# EAGLE design Thermostat-V3 (EAGLE 5.06)
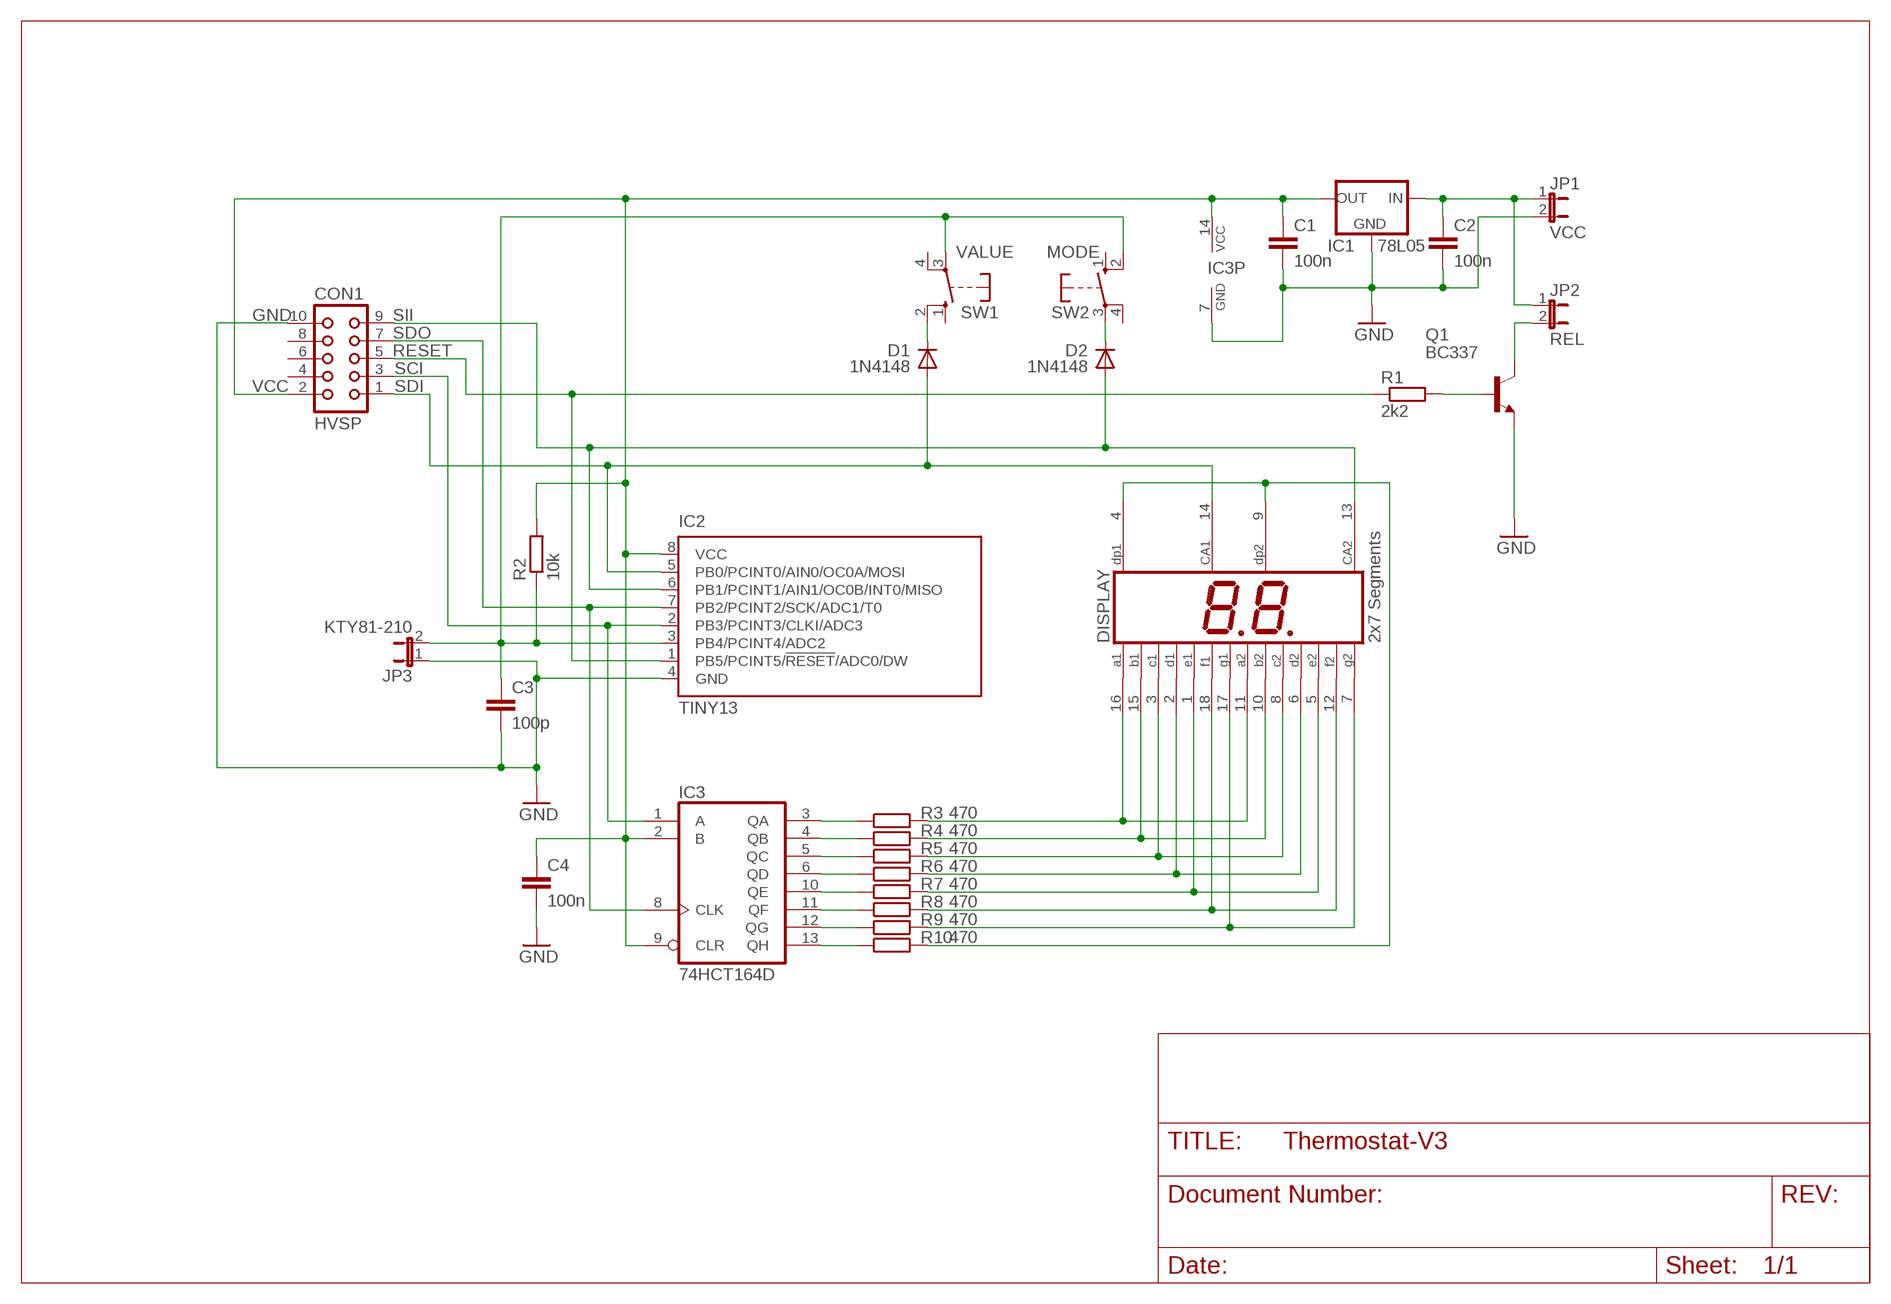
[diagram p0: schematic, sheet 1]

## Parts
C1  100n  C-EU025-024X044  [C025-024X044]
C2  100n  C-EU025-024X044  [C025-024X044]
C3  100p  C-EU025-024X044  [C025-024X044]
C4  100n  C-EU025-024X044  [C025-024X044]
CON1  HVSP  CON10  [CON10]
D1  1N4148  1N4148DO35-7  [DO35-7]
D2  1N4148  1N4148DO35-7  [DO35-7]
DISPLAY  2x7 Segments  HD-K121  [HDSP-R]
IC1  78L05  78LXX  [78LXX]
IC2  TINY13  TINY13-20SSU  [8S1]
IC3  74HCT164D  [SO14]
JP1  VCC  JP1E  [JP1]
JP2  REL  JP1E  [JP1]
JP3  KTY81-210  JP1E  [JP1]
Q1  BC337  BC337-40  [TO92]
R1  2k2  R-EU_0207/7  [0207/7]
R2  10k  R-EU_0207/7  [0207/7]
R3  470  R-EU_0207/7  [0207/7]
R4  470  R-EU_0207/7  [0207/7]
R5  470  R-EU_0207/7  [0207/7]
R6  470  R-EU_0207/7  [0207/7]
R7  470  R-EU_0207/7  [0207/7]
R8  470  R-EU_0207/7  [0207/7]
R9  470  R-EU_0207/7  [0207/7]
R10  470  R-EU_0207/7  [0207/7]
SW1  VALUE  DTE6  [DTE6-N]
SW2  MODE  DTE6  [DTE6-N]

## Nets
GND: C1.2 C2.2 C3.2 C4.2 CON1.10 IC1.GND IC2.4(GND) IC3.7(GND) JP1.2 JP3.1 Q1.1(E)
N$1: IC3.3(QA) R3.1
N$2: IC3.4(QB) R4.1
N$3: IC3.5(QC) R5.1
N$4: IC3.6(QD) R6.1
N$5: IC3.10(QE) R7.1
N$6: IC3.11(QF) R8.1
N$7: IC3.12(QG) R9.1
N$8: IC3.13(QH) R10.1
N$9: DISPLAY.11(A2) DISPLAY.16(A1) R3.2
N$10: DISPLAY.10(B2) DISPLAY.15(B1) R4.2
N$11: DISPLAY.3(C1) DISPLAY.8(C2) R5.2
N$12: DISPLAY.2(D1) DISPLAY.6(D2) R6.2
N$13: DISPLAY.1(E1) DISPLAY.5(E2) R7.2
N$14: DISPLAY.12(F2) DISPLAY.18(F1) R8.2
N$15: DISPLAY.7(G2) DISPLAY.17(G1) R9.2
N$16: DISPLAY.4(DP1) DISPLAY.9(DP2) R10.2
N$17: C3.1 IC2.3(PB4/PCINT4/ADC2) JP3.2 R2.1 SW1.3(P) SW2.2(S)
N$18: D1.C SW1.2(S)
N$19: D2.C SW2.3(P)
N$23: C2.1 IC1.IN JP1.1 JP2.1
N$26: Q1.2(B) R1.2
N$27: JP2.2 Q1.3(C)
RESET: CON1.5 IC2.1(PB5/PCINT5/!RESET!/ADC0/DW) R1.1
SCI: CON1.3 IC2.2(PB3/PCINT3/CLKI/ADC3) IC3.1(A)
SDI: CON1.1 D1.A DISPLAY.14(CA1) IC2.5(PB0/PCINT0/AIN0/OC0A/MOSI)
SDO: CON1.7 IC2.7(PB2/PCINT2/SCK/ADC1/T0) IC3.8(CLK)
SII: CON1.9 D2.A DISPLAY.13(CA2) IC2.6(PB1/PCINT1/AIN1/OC0B/INT0/MISO)
VCC: C1.1 C4.1 CON1.2 IC1.OUT IC2.8(VCC) IC3.2(B) IC3.9(CLR) IC3.14(VCC) R2.2
Unconnected: CON1.4 CON1.6 CON1.8 SW1.1(S) SW1.4(P) SW2.1(S) SW2.4(P)

## Library data of the parts
C1-C4 = rcl:C-EU: CAPACITOR, European symbol
CON1 = con-harting:CON10: CONNECTOR
D1 D2 = diode:1N4148: DIODE high speed (Philips)
DISPLAY = display-hp:HD-K121: LED DISPLAY 2 x 1 character 7 segment, decimal points right
IC1 = v-reg:78LXX: VOLTAGE REGULATOR
IC2 = atmel:TINY13: 8-bit AVR Microcontroller with 1K Bytes In-System Programmable Flash Source: http://www.atmel.com/dyn/resources/prod_documents/2535S.pdf
IC3 = 74xx-eu:74*164: 8-bit parallel out SHIFT REGISTER
JP1-JP3 = jumper:JP1E: JUMPER
Q1 = transistor-npn:BC337*: NPN Transistor
R1-R10 = rcl:R-EU_: RESISTOR, European symbol
SW1 SW2 = switch-misc:DT: ITT SWITCH

## Board
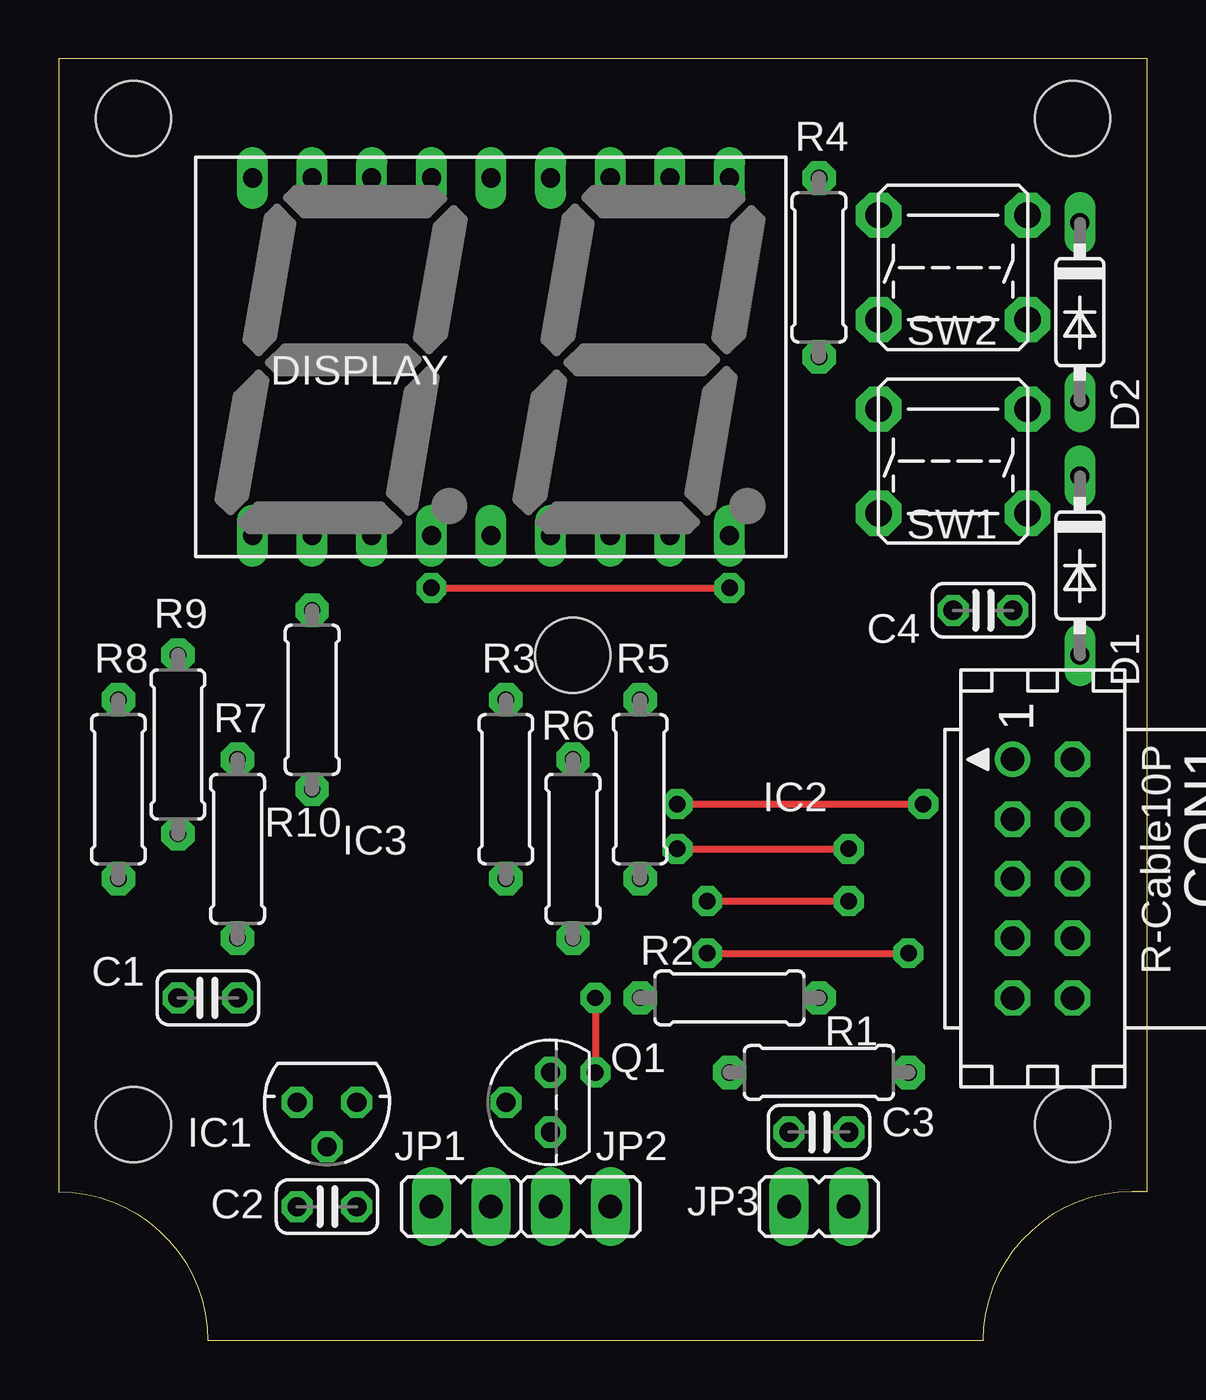
[diagram p1: board, top side]
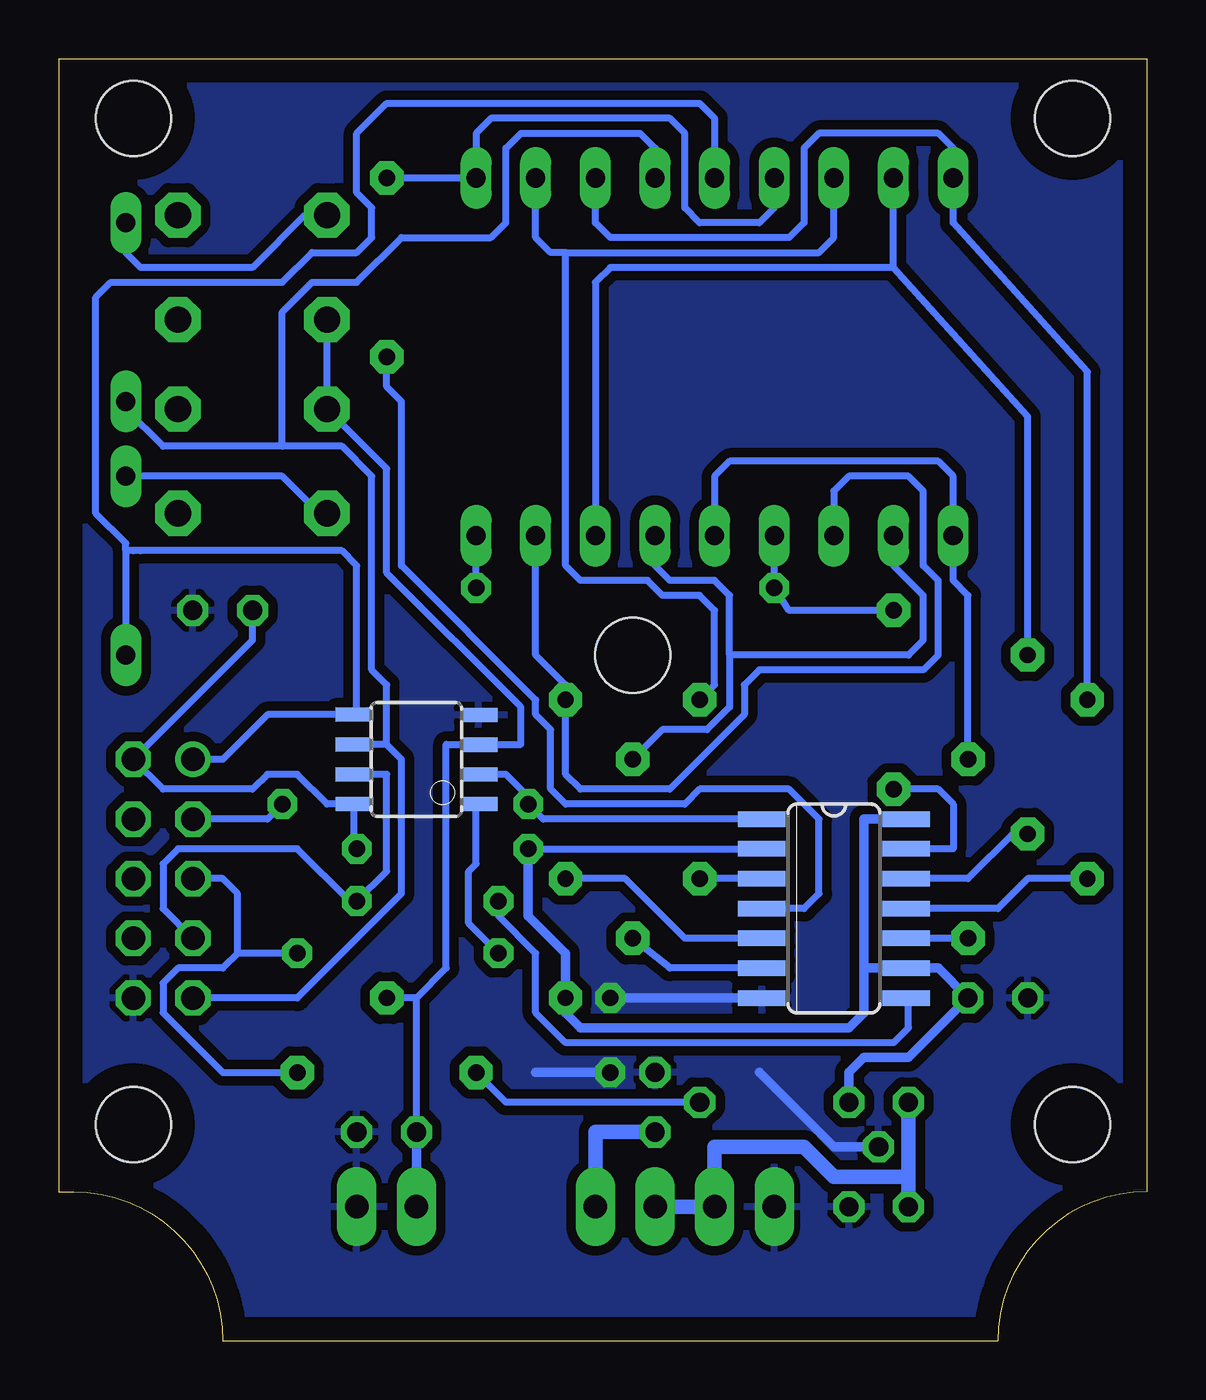
[diagram p2: board, bottom side, seen from below]

Size 46.35 x 54.61 mm. Coordinates in mm from the lower left corner, seen from the top.
Outline: 46.34,54.6 0,54.6 0,6.35 arc-90 6.35,0 39.37,0 arc-90 45.72,6.35 46.35,6.35 46.35,54.61
Copper layers (1*16): Top 0.035mm / dielectric 1.5mm / Bottom 0.035mm
Design rules "default *": minimum track width 10mil, minimum drill 25mil, track to track 8mil, track to pad 8mil, pad to pad 8mil, via to via 8mil, smd to smd 8mil, copper to edge 40mil, drill to drill 8mil, minimum pad ring 10mil, minimum via ring 8mil, stop-mask expansion 4mil, vias tented up to drill 0mil, thermal gap 10mil
Holes 3.2 mm at 3.17,52.07 43.18,52.07 21.91,29.21 43.18,9.21 3.17,9.21

### Footprints (pad centres in the part's own frame; a part is rotated, then mirrored left to right if it is on the bottom)
C025-024X044 = drill 0.813 octagon: 1 -1.27,0; 2 1.27,0
CON10 = drill 1 round: 1 -5.08,-1.27 | drill 1 octagon: 2 -5.08,1.27; 3 -2.54,-1.27; 4 -2.54,1.27; 5 0,-1.27; 6 0,1.27; 7 2.54,-1.27; 8 2.54,1.27; 9 5.08,-1.27; 10 5.08,1.27
DO35-7 = drill 0.813 long: A 3.81,0; C -3.81,0
HDSP-R = drill 0.813 long: 1 -10.16,-7.62; 2 -7.62,-7.62; 3 -5.08,-7.62; 4 -2.54,-7.62; 5 0,-7.62; 6 2.54,-7.62; 7 5.08,-7.62; 8 7.62,-7.62; 9 10.16,-7.62; 10 10.16,7.62; 11 7.62,7.62; 12 5.08,7.62; 13 2.54,7.62; 14 0,7.62; 15 -2.54,7.62; 16 -5.08,7.62; 17 -7.62,7.62; 18 -10.16,7.62
78LXX = drill 0.813 octagon: GND 0,1.905; IN 1.27,0; OUT -1.27,0
8S1 = smd 0.6 x 1.6: 1 -1.905,-2.654; 2 -0.645,-2.654; 3 0.625,-2.654; 4 1.895,-2.654; 5 1.905,2.654; 6 0.635,2.654; 7 -0.635,2.654; 8 -1.905,2.654
SO14 = smd 0.66 x 2.032: 1 -3.81,-3.073; 2 -2.54,-3.073; 3 -1.27,-3.073; 4 0,-3.073; 5 1.27,-3.073; 6 2.54,-3.073; 7 3.81,-3.073; 8 3.81,3.073; 9 2.54,3.073; 10 1.27,3.073; 11 0,3.073; 12 -1.27,3.073; 13 -2.54,3.073; 14 -3.81,3.073
JP1 = drill 1 pad 1.676 long: 1 0,-1.27; 2 0,1.27
TO92 = drill 0.813 octagon: 1 1.27,0; 2 0,1.905; 3 -1.27,0
0207/7 = drill 0.7 pad 1.422 octagon: 1 -3.81,0; 2 3.81,0
DTE6-N = drill 1.118 pad 1.93 octagon: 1 -3.175,2.223; 2 3.175,2.223; 3 3.175,-2.223; 4 -3.175,-2.223

### Placement (x,y rotation side)
C1  6.35,14.61 180 top
C2  11.43,5.71 0 top
C3  32.38,8.89 0 top
C4  39.37,31.12 0 top
CON1  41.91,19.69 270 top
D1  43.5,33.02 270 top
D2  43.5,43.81 270 top
DISPLAY  18.41,41.91 0 top
IC1  11.43,10.16 180 top
IC2  31.11,24.77 90 bottom
IC3  13.34,18.42 270 bottom
JP1  17.14,5.71 90 top
JP2  22.23,5.71 270 top
JP3  32.38,5.71 90 top
Q1  20.95,10.16 90 top
R1  32.38,11.43 180 top
R2  28.57,14.61 180 top
R3  19.05,23.5 90 top
R4  32.38,45.72 90 top
R5  24.77,23.5 90 top
R6  21.91,20.96 90 top
R7  7.62,20.96 90 top
R8  2.54,23.5 90 top
R9  5.08,25.4 90 top
R10  10.79,27.31 90 top
SW1  38.1,37.46 180 top
SW2  38.1,45.72 180 top

### Tracks (layer width: path | path; a pad name or v marks a point on that pad's centre or on a via)
GND  (via drill 0.7 pad 1.27)
  Top 0.305: v22.86,14.61 v22.86,11.43
  Bottom 0.406: v22.86,11.43 26.04,11.43 | IC3.7 v22.86,14.61 | IC1.GND 13.34,8.26 16.51,11.43
  pour Bottom (isolate 0.406): 0,54.61 46.35,54.61 46.35,0 0,0
N$1
  Bottom 0.305: IC3.3 R3.1
N$2
  Bottom 0.305: IC3.4 14.61,18.42 13.97,19.05 13.97,22.23 15.24,23.5 19.05,23.5 19.68,22.86 24.77,22.86 25.4,23.5 25.4,26.04 26.04,26.67 26.04,27.31 31.75,33.02 31.75,40 32.38,40.64 R4.1
N$3
  Bottom 0.305: R5.1 22.23,19.69 19.68,17.15 IC3.5
N$4
  Bottom 0.305: IC3.6 20.32,15.88 R6.1
N$5
  Bottom 0.305: R7.1 IC3.10
N$6
  Bottom 0.305: IC3.11 6.35,18.42 5.08,19.69 R8.1
N$7
  Bottom 0.305: R9.1 5.71,21.59 7.62,19.69 IC3.12
N$8
  Bottom 0.305: IC3.13 8.26,20.96 8.26,22.86 8.89,23.5 R10.1
N$9
  Bottom 0.305: DISPLAY.11 26.04,46.99 25.4,46.35 24.77,46.35 | 24.77,46.35 13.97,46.35 13.34,46.99 DISPLAY.16 | 24.77,46.35 24.77,33.02 24.13,32.38 21.27,32.38 20.64,31.75 19.05,31.75 18.41,31.12 18.41,27.94 R3.2
N$10
  Bottom 0.305: R4.2 DISPLAY.10 28.57,51.43 27.94,52.07 20.32,52.07 19.68,51.43 19.68,48.26 19.05,47.62 16.51,47.62 15.88,48.26 DISPLAY.15
N$11
  Bottom 0.305: DISPLAY.3 13.34,36.2 12.7,36.83 10.16,36.83 9.53,36.2 9.53,33.02 8.89,32.38 8.89,29.21 9.53,28.58 16.51,28.58 17.14,27.94 17.14,26.67 20.32,23.5 24.13,23.5 24.77,24.13 R5.2 24.77,27.94 26.04,29.21 DISPLAY.8
N$12
  Bottom 0.305: DISPLAY.2 10.79,33.02 9.53,31.75 9.53,29.85 10.16,29.21 17.78,29.21 | R6.2 20.64,26.04 18.73,26.04 17.78,26.99 17.78,29.21 | 17.78,29.21 17.78,31.75 18.41,32.38 20.32,32.38 20.95,33.02 DISPLAY.6
N$13
  Bottom 0.305: DISPLAY.5 18.41,36.83 17.78,37.46 8.89,37.46 8.26,36.83 DISPLAY.1 8.26,32.38 7.62,31.75 R7.2
N$14
  Bottom 0.305: R8.2 2.54,41.27 8.26,47.62 DISPLAY.18 8.26,50.8 8.89,51.43 13.97,51.43 14.61,50.8 14.61,47.62 15.24,46.99 22.86,46.99 23.5,47.62 DISPLAY.12
N$15
  Bottom 0.305: 10.79,45.72 DISPLAY.17 | 10.79,45.72 22.86,45.72 23.5,45.09 DISPLAY.7 | R9.2 5.08,39.37 10.79,45.72
N$16  (via drill 0.7 pad 1.27)
  Top 0.305: v15.88,32.07 v28.57,32.07
  Bottom 0.305: R10.2 15.24,31.12 v15.88,32.07 DISPLAY.4 | v28.57,32.07 DISPLAY.9
N$17
  Bottom 0.305: SW2.2 SW1.3 32.38,37.15 32.38,32.7 26.67,26.99 26.67,25.4 29.84,25.4 | 29.84,25.4 28.47,25.4 IC2.3 | 31.11,14.61 29.84,15.88 29.84,25.4 | 31.11,14.61 R2.1 | C3.1 31.11,14.61
  Bottom 0.406: JP3.2 C3.1
N$18
  Bottom 0.305: SW1.2 35.24,35.24 36.83,36.83 D1.C
N$19
  Bottom 0.305: SW2.3 35.88,47.94 38.1,45.72 42.86,45.72 43.5,46.35 D2.C
N$23
  Bottom 0.61: JP2.1 JP1.1 18.41,8.26 14.61,8.26 13.34,6.98 10.16,6.98 | C2.1 10.16,6.98 | 10.16,6.98 IC1.IN
N$26
  Bottom 0.305: R1.2 27.3,10.16 Q1.2
N$27
  Bottom 0.61: JP2.2 23.5,8.89 Q1.3
RESET  (via drill 0.7 pad 1.27)
  Top 0.305: v27.62,16.51 v36.2,16.51
  Bottom 0.305: IC2.1 28.57,22.75 28.57,20.32 28.89,20 28.89,17.78 v27.62,16.51 | v36.2,16.51 38.73,16.51 | 38.73,16.51 39.37,15.88 41.27,15.88 41.91,15.24 41.91,13.97 39.37,11.43 R1.1 | 38.73,16.51 38.73,19.05 39.37,19.69 CON1.5
SCI  (via drill 0.7 pad 1.27)
  Top 0.305: v26.35,22.86 v36.83,22.86
  Bottom 0.305: IC3.1 25.72,22.23 v26.35,22.86 26.35,23.18 27.3,24.13 28.45,24.13 IC2.2 | CON1.3 37.47,22.23 v36.83,22.86
SDI
  Bottom 0.305: DISPLAY.14 18.41,52.07 19.05,52.7 32.38,52.7 33.66,51.43 33.66,48.89 33.02,48.26 33.02,46.99 33.66,46.35 35.56,46.35 36.83,45.09 44.13,45.09 44.77,44.45 44.77,35.24 43.5,33.97 43.5,33.66 | 43.5,33.66 D1.A | CON1.1 39.37,24.77 37.47,26.67 IC2.5 33.66,26.67 33.66,33.02 34.29,33.66 42.86,33.66 | 42.86,33.66 43.18,33.66 | 42.86,33.66 43.5,33.66
SDO  (via drill 0.7 pad 1.27)
  Top 0.305: v27.62,18.73 v33.66,18.73
  Bottom 0.305: IC3.8 10.16,14.5 10.16,13.33 10.79,12.7 24.77,12.7 26.04,13.97 26.04,16.51 27.62,18.1 v27.62,18.73 | IC2.7 32.38,24.13 32.38,20 v33.66,18.73 33.97,18.73 36.2,20.96 41.27,20.96 41.91,20.32 41.91,18.42 CON1.7
SII
  Bottom 0.305: 43.5,39.69 41.91,38.1 36.83,38.1 | 36.83,38.1 34.29,38.1 33.02,36.83 33.02,28.58 32.38,27.94 32.38,25.4 | DISPLAY.13 20.95,50.8 21.59,51.43 26.67,51.43 27.3,50.8 27.3,47.62 27.94,46.99 31.75,46.99 33.66,45.09 35.56,45.09 36.83,43.81 36.83,38.1 | 32.38,25.4 IC2.6 | 32.38,25.4 31.75,24.77 31.75,19.05 36.2,14.61 CON1.9
  Bottom 0.406: 43.5,39.69 D2.A
VCC  (via drill 0.7 pad 1.27)
  Top 0.305: v26.35,20.96 v33.66,20.96
  Bottom 0.254: v33.66,20.96 33.66,21.27
  Bottom 0.305: v26.35,20.96 IC3.2 | v33.66,20.96 33.77,21.07 IC2.8 34.92,22.86 36.2,24.13 37.47,24.13 38.1,23.5 41.91,23.5 CON1.2 38.1,29.85 C4.1
  Bottom 0.406: 12.06,15.88 IC3.9 8.89,15.88 C1.1 10.16,12.06 12.06,12.06 12.7,11.43 IC1.OUT | 12.06,15.88 12.06,13.97 12.7,13.33 24.13,13.33 24.77,13.97 R2.2 24.77,16.51 26.35,18.1 v26.35,20.96 | 12.06,15.88 12.06,22.23 IC3.14